# EAGLE design Photon Battery Shield (EAGLE 7.1.0)
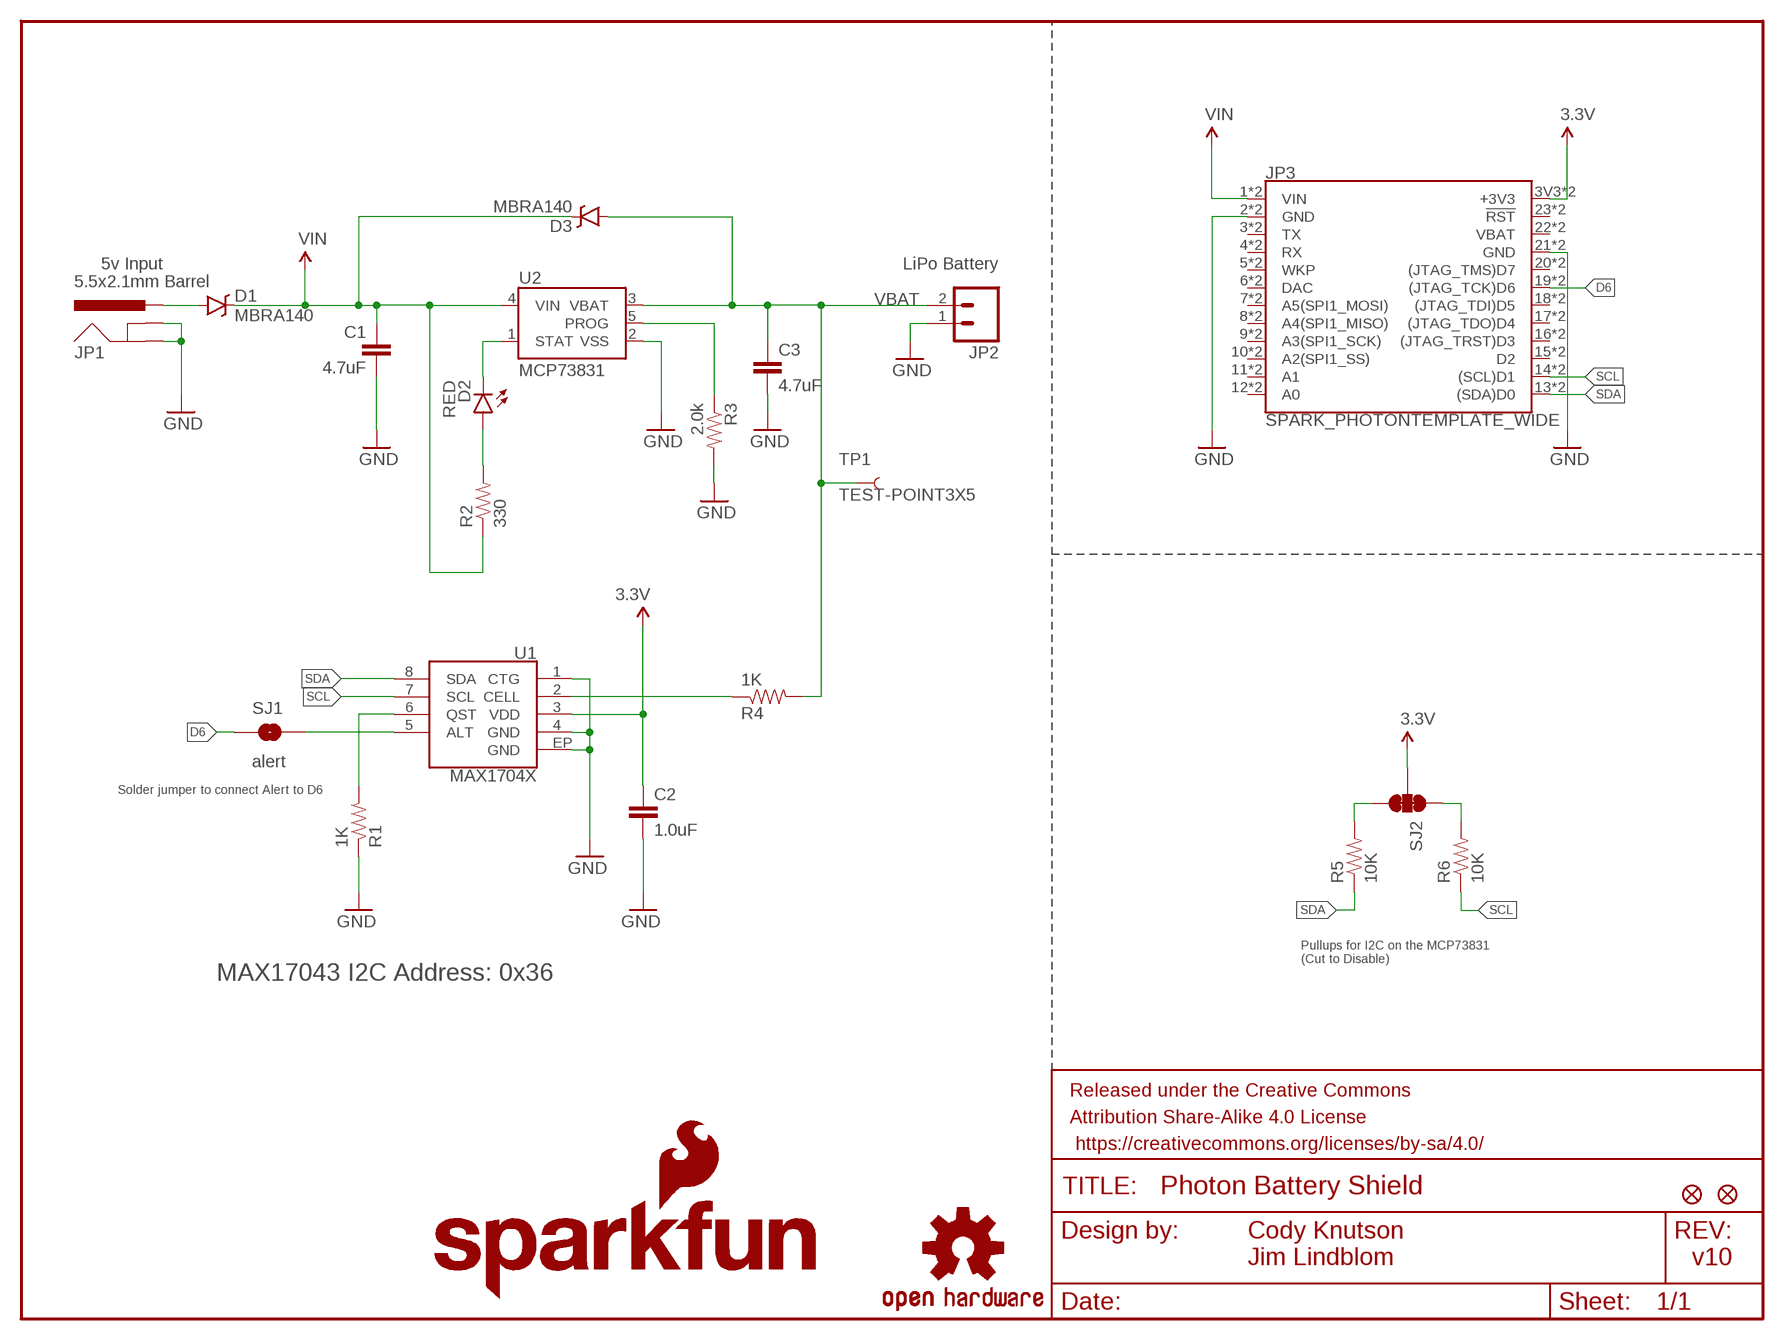
[diagram p0: schematic, sheet 1]

## Parts
C1  4.7uF  4.7UF-6.3V-10%(0603)0603  [0603-CAP]
C2  1.0uF  1.0UF-16V-10%(0603)  [0603-CAP]
C3  4.7uF  4.7UF-6.3V-10%(0603)0603  [0603-CAP]
D1  MBRA140  DIODE-SCHOTTKY-MBRA140  [SMA-DIODE]
D2  RED  LED-RED0603  [LED-0603]
D3  MBRA140  DIODE-SCHOTTKY-MBRA140  [SMA-DIODE]
FID1  FIDUCIAL1X2  [FIDUCIAL-1X2]
FID2  FIDUCIAL1X2  [FIDUCIAL-1X2]
FRAME1  FRAME-LETTER  [CREATIVE_COMMONS]
JP1  5.5x2.1mm Barrel  POWER_JACKSMD  [POWER_JACK_SMD]
JP2  M02-JST-2MM-SMT  [JST-2-SMD]
JP3  SPARK_PHOTONTEMPLATE_WIDE  [SPARK_PHOTON_TEMPLATE_WIDE]
LOGO2  OSHW-LOGOS  [OSHW-LOGO-S]
LOGO3  SFE_LOGO_NAME_FLAME.1_INCH  [SFE_LOGO_NAME_FLAME_.1]
R1  1K  1KOHM-1/10W-1%(0603)  [0603-RES]
R2  330  330OHM1/10W1%(0603)  [0603-RES]
R3  2.0k  2.0KOHM1/10W5%(0603)  [0603-RES]
R4  1K  1KOHM-1/10W-1%(0603)  [0603-RES]
R5  10K  10KOHM-1/10W-1%(0603)0603  [0603-RES]
R6  10K  10KOHM-1/10W-1%(0603)0603  [0603-RES]
SJ1  alert  JUMPER-PAD-2-NOYES_SILK  [PAD-JUMPER-2-NO_YES_SILK]
SJ2  JUMPER-PAD-3-NC_BY_TRACE  [PAD-JUMPER-3-3OF3_NC_BY_TRACE_YES_SILK_FULL_BOX]
TP1  TEST-POINT3X5  [PAD.03X.05]
U1  MAX1704X  [TDFN-8]
U2  MCP73831  [SOT23-5]

## Nets
3.3V: C2.1 JP3.3V3(+3V3) JP3.24(+3V3) SJ2.2 U1.3(VDD)
D6: JP3.19((JTAG_TCK)D6) JP3.D6((JTAG_TCK)D6) SJ1.1
GND: C1.2 C2.2 C3.2 JP1.GND(GNDBREAK) JP1.P$4(GND) JP2.1 JP3.2(GND) JP3.21(GND) JP3.GND@0(GND) JP3.GND@2(GND) R1.1 R3.2 U1.1(CTG) U1.4(GND) U1.EP(GND) U2.2(VSS)
N$1: D2.A R2.2
N$2: D2.C U2.1(STAT)
N$3: R3.1 U2.5(PROG)
N$4: SJ1.2 U1.5(ALT)
N$5: R4.1 U1.2(CELL)
N$6: R1.2 U1.6(QST)
N$7: R5.2 SJ2.3
N$8: D1.A JP1.VIN0(PWR)
N$9: R6.2 SJ2.1
SCL: JP3.14((SCL)D1) JP3.D1((SCL)D1) R6.1 U1.7(SCL)
SDA: JP3.13((SDA)D0) JP3.D0((SDA)D0) R5.1 U1.8(SDA)
VBAT: C3.1 D3.A JP2.2 R4.2 TP1.P$1 U2.3(VBAT)
VIN: C1.1 D1.C D3.C JP3.1(VIN) JP3.VIN R2.1 U2.4(VIN)
Unconnected: JP3.3(TX) JP3.4(RX) JP3.5(WKP) JP3.6(DAC) JP3.7(A5(SPI1_MOSI)) JP3.8(A4(SPI1_MISO)) JP3.9(A3(SPI1_SCK)) JP3.10(A2(SPI1_SS)) JP3.11(A1) JP3.12(A0) JP3.15(D2) JP3.16((JTAG_TRST)D3) JP3.17((JTAG_TDO)D4) JP3.18((JTAG_TDI)D5) JP3.20((JTAG_TMS)D7) JP3.22(VBAT) JP3.23(!RST!) JP3.A0 JP3.A1 JP3.A2(A2(SPI1_SS)) JP3.A3(A3(SPI1_SCK)) JP3.A4(A4(SPI1_MISO)) JP3.A5(A5(SPI1_MOSI)) JP3.D2 JP3.D3((JTAG_TRST)D3) JP3.D4((JTAG_TDO)D4) JP3.D5((JTAG_TDI)D5) JP3.D7((JTAG_TMS)D7) JP3.DAC JP3.RST(!RST!) JP3.RX JP3.TX JP3.VBAT JP3.WKP

## Notes on the sheet
- 5v Input | LiPo Battery
- Solder jumper to connect Alert to D6
- Pullups for I2C on the MCP73831
  (Cut to Disable)
- MAX17043 I2C Address: 0x36
- Cody Knutson
  Jim Lindblom
- v10

## Library data of the parts
C1 C3 = SparkFun-Capacitors:4.7UF-6.3V-10%(0603): CAP-08280; PROD_ID: CAP-08280
C2 = SparkFun-Capacitors:1.0UF-16V-10%(0603): CAP-00868; PROD_ID: CAP-00868
D1 D3 = SparkFun-DiscreteSemi:DIODE-SCHOTTKY: Schottky diodes in SFE's production catalog BAT20J 1A 23V 0.62Vf RB751 120mA 40V 0.37Vf PMEG4005EJ 0.5A 40V 0.42Vf MBRA140 1A 40V 0.5Vf B340A 3A 40V SMA; PROD_ID: DIO-08053
D2 = SparkFun-LED:LED-RED: Assorted Red LEDs LilyPad 1206- DIO-09912 1206- DIO-00809 0603- DIO-00819; PROD_ID: DIO-00819
FID1 FID2 = SparkFun-Aesthetics:FIDUCIAL: Fiducial Alignment Points Various fiducial points for machine vision alignment.
FRAME1 = SparkFun-Aesthetics:FRAME-LETTER: Schematic Frame Standard 8.5x11 US Letter frame; DESIGNER: NAME; VERSION: v01
JP1 = SparkFun-Connectors:POWER_JACK: Power Jack This is the standard 5.5mm barrel jack for power. The PTH is the most common, proven, reliable, footprint. The Slot footprint only works if the mill layer is transmitted to the PCB fab house so be warned. Mating wall wart : TOL-00298 (and others); PROD_ID: CONN-08106; SF_ID: PRT-12748
JP2 = SparkFun-Connectors:M02: Standard 2-pin 0.1" header. Use with - straight break away headers ( PRT-00116) - right angle break away headers (PRT-00553) - swiss pins (PRT-00743) - machine pins (PRT-00117) - female headers (PRT-00115) Molex polarized connector foot print use with: PRT-08233 with associated crimp pins and housings. 2.54_SCREWTERM for use with PRT-10571. 3.5mm Screw Terminal footprints for PRT-08084 5mm Screw Terminal footprints for use with PRT-08432; PROD_ID: CONN-11443
JP3 = template_temp:SPARK_PHOTON
LOGO2 = SparkFun-Aesthetics:OSHW-LOGO: Open Source Hardware Logo This logo indicates the piece of hardware it is found on incorporates a OSHW license and/or adheres to the definition of open source hardware found here: http://freedomdefined.org/OSHW
LOGO3 = SparkFun-Aesthetics:SFE_LOGO_NAME_FLAME: SFE Logo, name and flame This is the SparkFun full logo. The logo on the schematic will always be the same size; the package variant is the height of the flame part of the logo. Default layer for the logo on the board is tSilk.
R1 R4 = SparkFun-Resistors:1KOHM-1/10W-1%(0603): RES-07856; PROD_ID: RES-07856
R2 = SparkFun-Resistors:330OHM1/10W1%(0603): RES-00818; PROD_ID: RES-00818
R3 = SparkFun-Resistors:2.0KOHM1/10W5%(0603): RES-08296; PROD_ID: RES-08296
R5 R6 = SparkFun-Resistors:10KOHM-1/10W-1%(0603): RES-00824; PROD_ID: RES-00824
SJ1 = SparkFun-Passives:JUMPER-PAD-2-NO
SJ2 = SparkFun-Passives:JUMPER-PAD-3-NC_BY_TRACE
TP1 = SparkFun-Passives:TEST-POINT: Bare copper test points for troubleshooting or ICT
U1 = SparkFun-PowerIC:MAX1704X: MAX17043/MAX17044: Battery Fuel Guage (43 is 1cell, 44 is 2cell); PROD_ID: IC-10399
U2 = SparkFun-PowerIC:MCP73831: Miniature single cell, fully integrated Li-Ion, Li-polymer charge management controller http://ww1.microchip.com/downloads/en/DeviceDoc/21984a.pdf IC-09995; PROD_ID: IC-09995

## Board
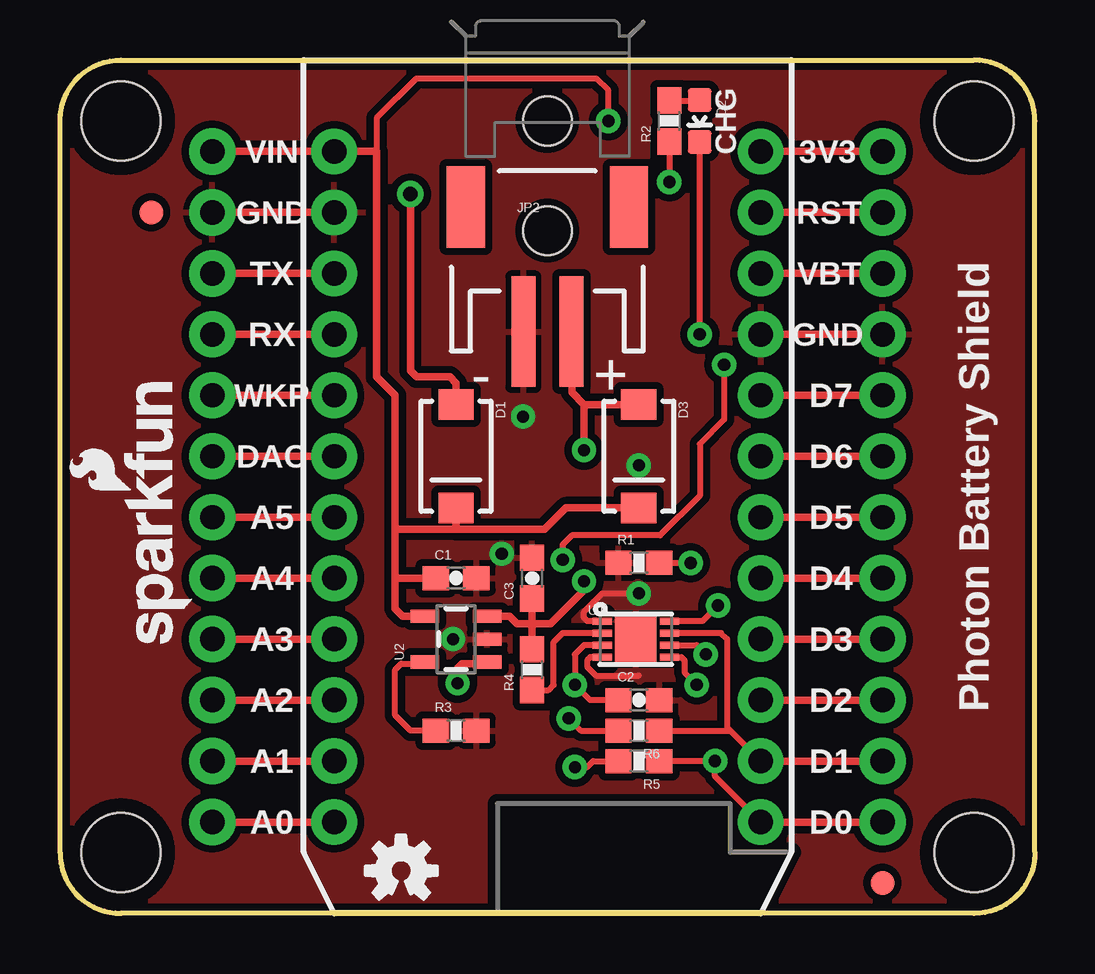
[diagram p1: board, top side]
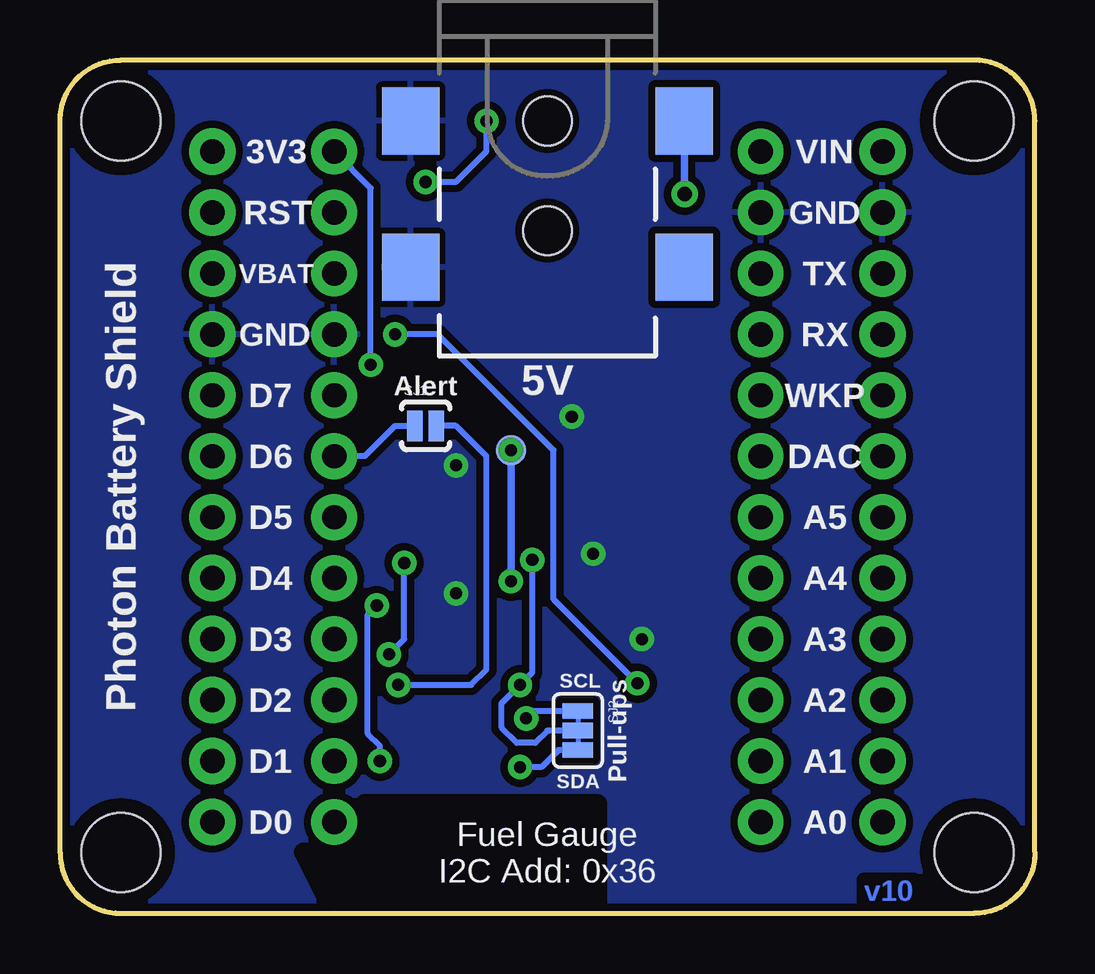
[diagram p2: board, bottom side, seen from below]

Size 40.64 x 35.57 mm. Coordinates in mm from the lower left corner, seen from the top.
Outline: 11.43,0 29.21,0.01
Outline: 2.54,35.57 38.1,35.57 arc-90 40.64,33.03 40.64,2.55 arc-90 38.1,0.01 2.54,0.01 arc-90 0,2.55 0,33.03 arc-90 2.54,35.57
Copper layers (1*16): Top 0.035mm / dielectric 1.5mm / Bottom 0.035mm
Design rules "SparkFun-2-layer": minimum track width 7mil, minimum drill 15mil, track to track 8mil, track to pad 8mil, pad to pad 8mil, via to via 8mil, smd to smd 8mil, copper to edge 8mil, drill to drill 8mil, minimum pad ring 12mil, minimum via ring 10mil, stop-mask expansion 4mil, vias tented up to drill 20mil, thermal gap 10mil
tRestrict: 2 lines

### Footprints (pad centres in the part's own frame; a part is rotated, then mirrored left to right if it is on the bottom)
0603-CAP = smd 1.1 x 1: 1 -0.85,0; 2 0.85,0
SMA-DIODE = smd 1.27 x 1.47: A -2.15,0; C 2.15,0
LED-0603 = smd 1 x 1: A 0,-0.877; C 0,0.877
FIDUCIAL-1X2 = smd 1 x 1: 1 0,0
POWER_JACK_SMD = smd 2.8 x 2.4: GND 0,-5.7; P$4 6.1,-5.7; VIN0 0,5.7; VIN1 6.1,5.7 | hole 2.032: 0,0; 4.572,0
JST-2-SMD = smd 1 x 4.6: 1 -1,-3.7; 2 1,-3.7 | smd 1.6 x 3.4: NC1 -3.4,1.5; NC2 3.4,1.5
SPARK_PHOTON_TEMPLATE_WIDE = drill 1.016 pad 1.905: 1 1.27,31.75; 2 1.27,29.21; 3 1.27,26.67; 4 1.27,24.13; 5 1.27,21.59; 6 1.27,19.05; 7 1.27,16.51; 8 1.27,13.97; 9 1.27,11.43; 10 1.27,8.89; 11 1.27,6.35; 12 1.27,3.81; 13 19.05,3.81; 14 19.05,6.35; 15 19.05,8.89; 16 19.05,11.43; 17 19.05,13.97; 18 19.05,16.51; 19 19.05,19.05; 20 19.05,21.59; 21 19.05,24.13; 22 19.05,26.67; 23 19.05,29.21; 24 19.05,31.75 | drill 1.016 pad 1.93: 3V3 24.13,31.75; A0 -3.81,3.81; A1 -3.81,6.35; A2 -3.81,8.89; A3 -3.81,11.43; A4 -3.81,13.97; A5 -3.81,16.51; D0 24.13,3.81; D1 24.13,6.35; D2 24.13,8.89; D3 24.13,11.43; D4 24.13,13.97; D5 24.13,16.51; D6 24.13,19.05; D7 24.13,21.59; DAC -3.81,19.05; GND@0 -3.81,29.21; GND@2 24.13,24.13; RST 24.13,29.21; RX -3.81,24.13; TX -3.81,26.67; VBAT 24.13,26.67; VIN -3.81,31.75; WKP -3.81,21.59 | hole 3.302: -7.62,33.02; 27.94,33.02; -7.62,2.54; 27.94,2.54
0603-RES = smd 1.1 x 1: 1 -0.85,0; 2 0.85,0
PAD-JUMPER-2-NO_YES_SILK = smd 0.635 x 1.27: 1 -0.45,0; 2 0.45,0
PAD-JUMPER-3-3OF3_NC_BY_TRACE_YES_SILK_FULL_BOX = smd 0.635 x 1.27: 1 -0.813,0; 2 0,0; 3 0.813,0
PAD.03X.05 = smd 1.27 x 1.27: P$1 0,0
TDFN-8 = smd 0.8 x 0.3: 1 -1.4,0.75; 2 -1.4,0.25; 3 -1.4,-0.25; 4 -1.4,-0.75; 5 1.4,-0.75; 6 1.4,-0.25; 7 1.4,0.25; 8 1.4,0.75 | smd 1.73 x 1.88: EP 0,0
SOT23-5 = smd 0.55 x 1.2: 1 -0.95,-1.3; 2 0,-1.3; 3 0.95,-1.3; 4 0.95,1.3; 5 -0.95,1.3

### Placement (x,y rotation side)
C1  16.51,13.98 0 top
C2  24.13,8.9 0 top
C3  19.68,13.98 90 top
D1  16.51,19.06 270 top
D2  26.67,33.03 180 top
D3  24.13,19.06 270 top
FID1  34.29,1.28 0 top
FID2  3.81,29.22 0 top
FRAME1  -9.36,-15.23 0 top  (outside the outline)
JP1  20.32,33.03 270 bottom
JP2  20.32,27.95 0 top
JP3  10.16,0.01 0 top
LOGO2  14.22,1.79 0 top
LOGO3  5.59,10.8 90 top
R1  24.13,14.62 0 top
R2  25.4,33.03 90 top
R3  16.51,7.63 0 top
R4  19.68,10.17 90 top
R5  24.13,6.36 180 top
R6  24.13,7.63 180 top
SJ1  25.4,20.33 0 bottom
SJ2  19.05,7.63 270 bottom
TP1  21.84,19.31 0 bottom
U1  24,11.44 0 top
U2  16.51,11.44 90 top

### Tracks (layer width: path | path; a pad name or v marks a point on that pad's centre or on a via)
3.3V  (via drill 0.51)
  Top 0.254: C2.1 22.1,8.9 v21.46,9.54 21.46,10.8 21.85,11.19 U1.3 | v27.69,22.87 27.69,20.58 26.67,19.57 26.67,17.41 25.02,15.76 21.34,15.76 20.95,15.38 v20.95,14.74
  Bottom 0.254: v27.69,22.87 27.69,30.24 JP3.24 | SJ2.2 20.32,7.63 20.83,7.12 21.59,7.12 22.23,7.76 22.23,8.77 v21.46,9.54 20.95,10.04 v20.95,14.74
D6
  Bottom 0.254: JP3.19 27.94,19.06 26.67,20.33 SJ1.1
GND  (via drill 0.51)
  Top 0.254: U1.1 21.98,12.19 21.84,12.33 21.84,12.58 22.61,13.35 v24.13,13.35 | U1.4 22.11,10.69 21.97,10.55 21.97,10.3 22.35,9.92 24.13,9.92
  other vias: 24.13,18.68 19.3,20.71 18.41,15 16.38,11.44
  pour Bottom (isolate 0.305): 0,35.57 0,0.01 40.64,0.01 40.64,35.57
  pour Top (isolate 0.305): 0,35.57 0,0.01 40.64,0.01 40.64,35.57
N$1
  Top 0.254: R2.2 26.64,33.88 D2.A
N$2  (via drill 0.51)
  Top 0.254: U2.1 17.46,10.49 | v26.67,24.14 D2.C
  Top 0.305: v16.57,9.6 16.57,10.23 16.76,10.42 17.74,10.42 U2.1
  Bottom 0.254: v16.57,9.6 20.07,13.1 20.07,19.31 24.89,24.14 v26.67,24.14
N$3
  Top 0.254: R3.1 14.61,7.63 13.97,8.27 13.97,10.17 14.22,10.42 15.14,10.42 U2.5
N$4  (via drill 0.51)
  Top 0.254: U1.5 25.9,10.69 26.04,10.55 26.04,10.04 v26.54,9.54
  Bottom 0.254: v26.54,9.54 23.5,9.54 22.86,10.17 22.86,19.06 24.13,20.33 SJ1.2
N$5
  Top 0.254: U1.2 20.95,11.69 20.57,11.31 20.57,9.54 20.36,9.32 R4.1
N$6  (via drill 0.51)
  Top 0.254: R1.2 v26.29,14.62 | U1.6 26.54,11.19 v26.92,10.8
  Bottom 0.254: v26.92,10.8 26.29,11.44 v26.29,14.62
N$7  (via drill 0.51)
  Top 0.254: v21.46,6.11 21.97,6.11 22.23,6.36 R5.2
  Bottom 0.254: SJ2.3 19.86,6.82 20.57,6.11 v21.46,6.11
N$8  (via drill 0.6)
  Top 0.305: 16.27,21.21 D1.A 16.51,22.11 16.26,22.36 14.86,22.36 14.61,22.62 v14.61,29.98
  Bottom 0.254: 14.61,33.02 JP1.VIN0
  Bottom 0.305: v14.61,29.98 14.61,33.02
N$9  (via drill 0.51)
  Top 0.254: v21.21,8.14 21.72,7.63 R6.2
  Bottom 0.254: SJ2.1 20.9,8.44 v21.21,8.14
SCL
  Top 0.254: R6.1 27.94,7.63 | U1.7 27.56,11.69 27.81,11.44 27.81,7.76 27.94,7.63 | 27.94,7.63 JP3.14
SDA  (via drill 0.51)
  Top 0.254: JP3.13 27.3,5.72 v27.3,6.36 R5.1 25.4,6.36 | U1.8 25.41,12.2 26.8,12.2 v27.43,12.84
  Bottom 0.254: v27.3,6.36 27.3,7 27.81,7.5 27.81,12.46 v27.43,12.84
VBAT  (via drill 0.51)
  Top 0.254: 21.84,21.2 21.85,21.21 | 21.34,24.23 JP2.2
  Top 0.305: D3.A 21.85,21.21 21.34,21.73 21.34,24.23 | TP1.P$1 21.84,21.2 | U2.3 18.73,12.39 19.05,12.07 19.68,12.07 | C3.1 19.68,12.07 | R4.2 19.68,12.07 | 19.68,12.07 20.45,12.07 21.84,13.47 v21.84,13.85
  Bottom 0.305: v21.84,13.85 TP1.P$1
  other vias: 21.84,19.31
VIN  (via drill 0.51)
  Top 0.254: 13.21,31.76 13.21,33.16 14.86,34.81 22.35,34.81 22.86,34.3 v22.86,33.03 | R2.1 v25.4,30.49
  Top 0.305: JP3.1 13.21,31.76 13.21,22.36 13.97,21.6 13.97,16.01 | 13.97,16.01 13.97,13.98 | 13.97,13.98 13.97,12.71 14.29,12.39 U2.4 | C1.1 13.97,13.98 | D1.C 16.51,16.01 | 16.51,16.01 20.19,16.01 21.09,16.91 D3.C | 16.51,16.01 13.97,16.01
  Bottom 0.254: v25.4,30.49 24.13,30.49 22.86,31.76 v22.86,33.03

### Text on the board
Bottom: v10
tPlace: CHG | Photon Battery Shield
bPlace: 5V | Alert | Photon Battery Shield | SCL | Pull-ups | SDA | Fuel Gauge / I2C Add: 0x36
tDocu: Cody Knutson